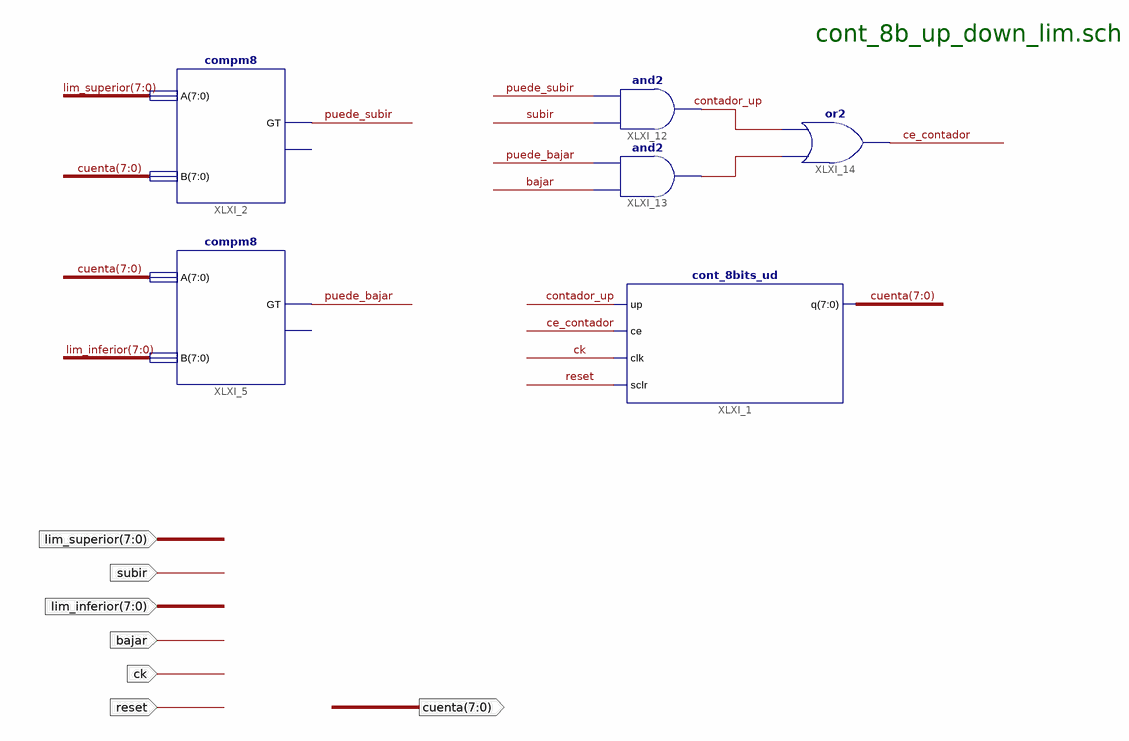
[diagram p0: schematic sheet 1]
// Xilinx ISE schematic cont_8b_up_down_lim.sch (spartan6) as structural Verilog: 6 symbols, 7 ports
module cont_8b_up_down_lim (
  input  bajar,
  input  ck,
  input  reset,
  input  [7:0] lim_superior,
  input  subir,
  input  [7:0] lim_inferior,
  output [7:0] cuenta
);

  wire ce_contador, contador_up, puede_bajar, puede_subir, XLXN_71;

  compm8 XLXI_2 (.A(lim_superior), .B(cuenta), .GT(puede_subir));  // open: LT
  compm8 XLXI_5 (.A(cuenta), .B(lim_inferior), .GT(puede_bajar));  // open: LT
  and XLXI_12 (contador_up, subir, puede_subir);
  and XLXI_13 (XLXN_71, bajar, puede_bajar);
  or XLXI_14 (ce_contador, XLXN_71, contador_up);
  cont_8bits_ud XLXI_1 (.up(contador_up), .sclr(reset), .q(cuenta), .clk(ck), .ce(ce_contador));

  // Notes on the sheet:
  //   cont_8b_up_down_lim.sch
endmodule
